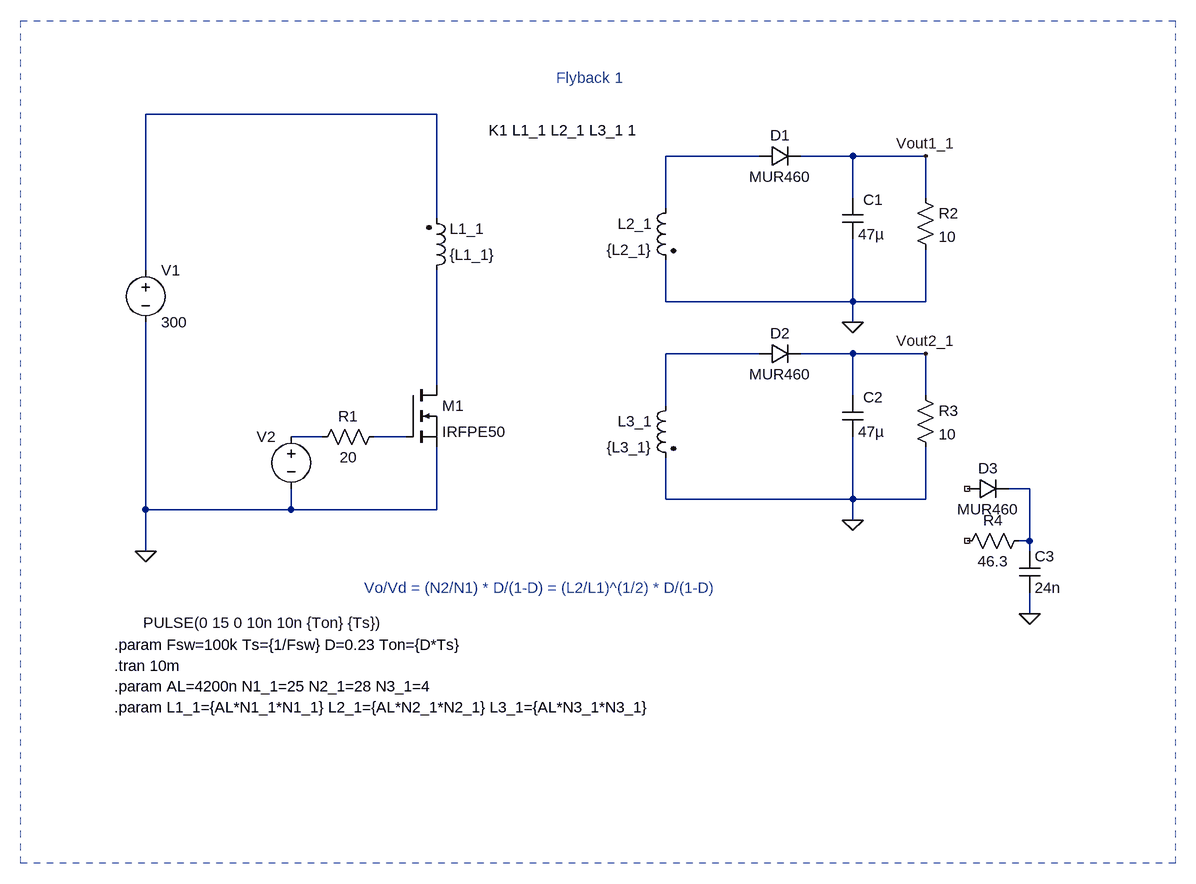
[diagram p0: schematic flyback_1.asc]
flyback_1.asc, the LTspice schematic file:
Version 4
SHEET 1 1092 932
WIRE -48 -224 -496 -224
WIRE 448 -160 304 -160
WIRE 592 -160 512 -160
WIRE 704 -160 592 -160
WIRE 592 -96 592 -160
WIRE 704 -96 704 -160
WIRE 304 -80 304 -160
WIRE -48 -64 -48 -224
WIRE -496 16 -496 -224
WIRE 304 64 304 0
WIRE 592 64 592 -32
WIRE 592 64 304 64
WIRE 704 64 704 -16
WIRE 704 64 592 64
WIRE 592 96 592 64
WIRE 448 144 304 144
WIRE 592 144 512 144
WIRE 704 144 592 144
WIRE -48 192 -48 16
WIRE 592 208 592 144
WIRE 704 208 704 144
WIRE 304 224 304 144
WIRE -224 272 -272 272
WIRE -96 272 -144 272
WIRE 864 352 832 352
WIRE 304 368 304 304
WIRE 592 368 592 272
WIRE 592 368 304 368
WIRE 704 368 704 288
WIRE 704 368 592 368
WIRE -496 384 -496 96
WIRE -272 384 -272 352
WIRE -272 384 -496 384
WIRE -48 384 -48 288
WIRE -48 384 -272 384
WIRE 592 400 592 368
WIRE 864 432 864 352
WIRE 864 432 848 432
WIRE -496 448 -496 384
WIRE 864 448 864 432
WIRE 864 544 864 512
FLAG -496 448 0
FLAG 704 -160 Vout1_1
FLAG 704 144 Vout2_1
FLAG 592 96 0
FLAG 592 400 0
FLAG 864 544 0
SYMBOL nmos -96 192 R0
SYMATTR InstName M1
SYMATTR Value IRFPE50
SYMBOL diode 448 -144 R270
WINDOW 0 32 32 VTop 2
WINDOW 3 0 32 VBottom 2
SYMATTR InstName D1
SYMATTR Value MUR460
SYMBOL voltage -496 0 R0
WINDOW 123 0 0 Left 0
WINDOW 39 0 0 Left 0
SYMATTR InstName V1
SYMATTR Value 300
SYMBOL res -128 256 R90
WINDOW 0 0 56 VBottom 2
WINDOW 3 32 56 VTop 2
SYMATTR InstName R1
SYMATTR Value 20
SYMBOL cap 576 -96 R0
WINDOW 0 32 3 Left 2
SYMATTR InstName C1
SYMATTR Value 47µ
SYMBOL res 688 -112 R0
SYMATTR InstName R2
SYMATTR Value 10
SYMBOL ind2 -64 32 M180
WINDOW 0 36 80 Left 2
WINDOW 3 36 40 Left 2
SYMATTR InstName L1_1
SYMATTR Value {L1_1}
SYMATTR Type ind
SYMBOL ind2 320 -96 M0
SYMATTR InstName L2_1
SYMATTR Value {L2_1}
SYMATTR Type ind
SYMBOL diode 448 160 R270
WINDOW 0 32 32 VTop 2
WINDOW 3 0 32 VBottom 2
SYMATTR InstName D2
SYMATTR Value MUR460
SYMBOL cap 576 208 R0
WINDOW 0 32 3 Left 2
SYMATTR InstName C2
SYMATTR Value 47µ
SYMBOL res 688 192 R0
SYMATTR InstName R3
SYMATTR Value 10
SYMBOL ind2 320 208 M0
SYMATTR InstName L3_1
SYMATTR Value {L3_1}
SYMATTR Type ind
SYMBOL diode 768 368 R270
WINDOW 0 32 32 VTop 2
WINDOW 3 0 32 VBottom 2
SYMATTR InstName D3
SYMATTR Value MUR460
SYMBOL cap 848 448 R0
SYMATTR InstName C3
SYMATTR Value 24n
SYMBOL res 864 416 R90
WINDOW 0 0 56 VBottom 2
WINDOW 3 32 56 VTop 2
SYMATTR InstName R4
SYMATTR Value 46.3
SYMBOL voltage -272 256 M0
WINDOW 123 0 0 Left 0
WINDOW 39 0 0 Left 0
WINDOW 3 -144 302 Left 2
SYMATTR InstName V2
SYMATTR Value PULSE(0 15 0 10n 10n {Ton} {Ts})
TEXT -160 504 Left 2 ;Vo/Vd = (N2/N1) * D/(1-D) = (L2/L1)^(1/2) * D/(1-D)
TEXT 32 -200 Left 2 !K1 L1_1 L2_1 L3_1 1
TEXT 136 -280 Left 2 ;Flyback 1
TEXT -544 624 Left 2 !.tran 10m
TEXT -544 592 Left 2 !.param Fsw=100k Ts={1/Fsw} D=0.23 Ton={D*Ts}
TEXT -544 656 Left 2 !.param AL=4200n N1_1=25 N2_1=28 N3_1=4
TEXT -544 688 Left 2 !.param L1_1={AL*N1_1*N1_1} L2_1={AL*N2_1*N2_1} L3_1={AL*N3_1*N3_1}
RECTANGLE Normal 1088 928 -688 -368 2

The netlist it stands for:
* flyback_1.asc
M1 N004 N006 0 0 IRFPE50
D1 N002 Vout1_1 MUR460
V1 N001 0 300
R1 N006 N005 20
C1 Vout1_1 0 47µ
R2 Vout1_1 0 10
L1_1 N004 N001 {L1_1}
L2_1 N002 0 {L2_1}
D2 N003 Vout2_1 MUR460
C2 Vout2_1 0 47µ
R3 Vout2_1 0 10
L3_1 N003 0 {L3_1}
D3 NC_01 N007 MUR460
C3 N007 0 24n
R4 N007 NC_02 46.3
V2 N005 0 PULSE(0 15 0 10n 10n {Ton} {Ts})
.model D D
.lib standard.dio
.model NMOS NMOS
.model PMOS PMOS
.lib standard.mos
* Vo/Vd = (N2/N1) * D/(1-D) = (L2/L1)^(1/2) * D/(1-D)
K1 L1_1 L2_1 L3_1 1
* Flyback 1
.tran 10m
.param Fsw=100k Ts={1/Fsw} D=0.23 Ton={D*Ts}
.param AL=4200n N1_1=25 N2_1=28 N3_1=4
.param L1_1={AL*N1_1*N1_1} L2_1={AL*N2_1*N2_1} L3_1={AL*N3_1*N3_1}
.backanno
.end